# Altium schematic sheet OECU_BASE6.SchDoc
size A4; SheetNumber: 6; SheetTotal: 6
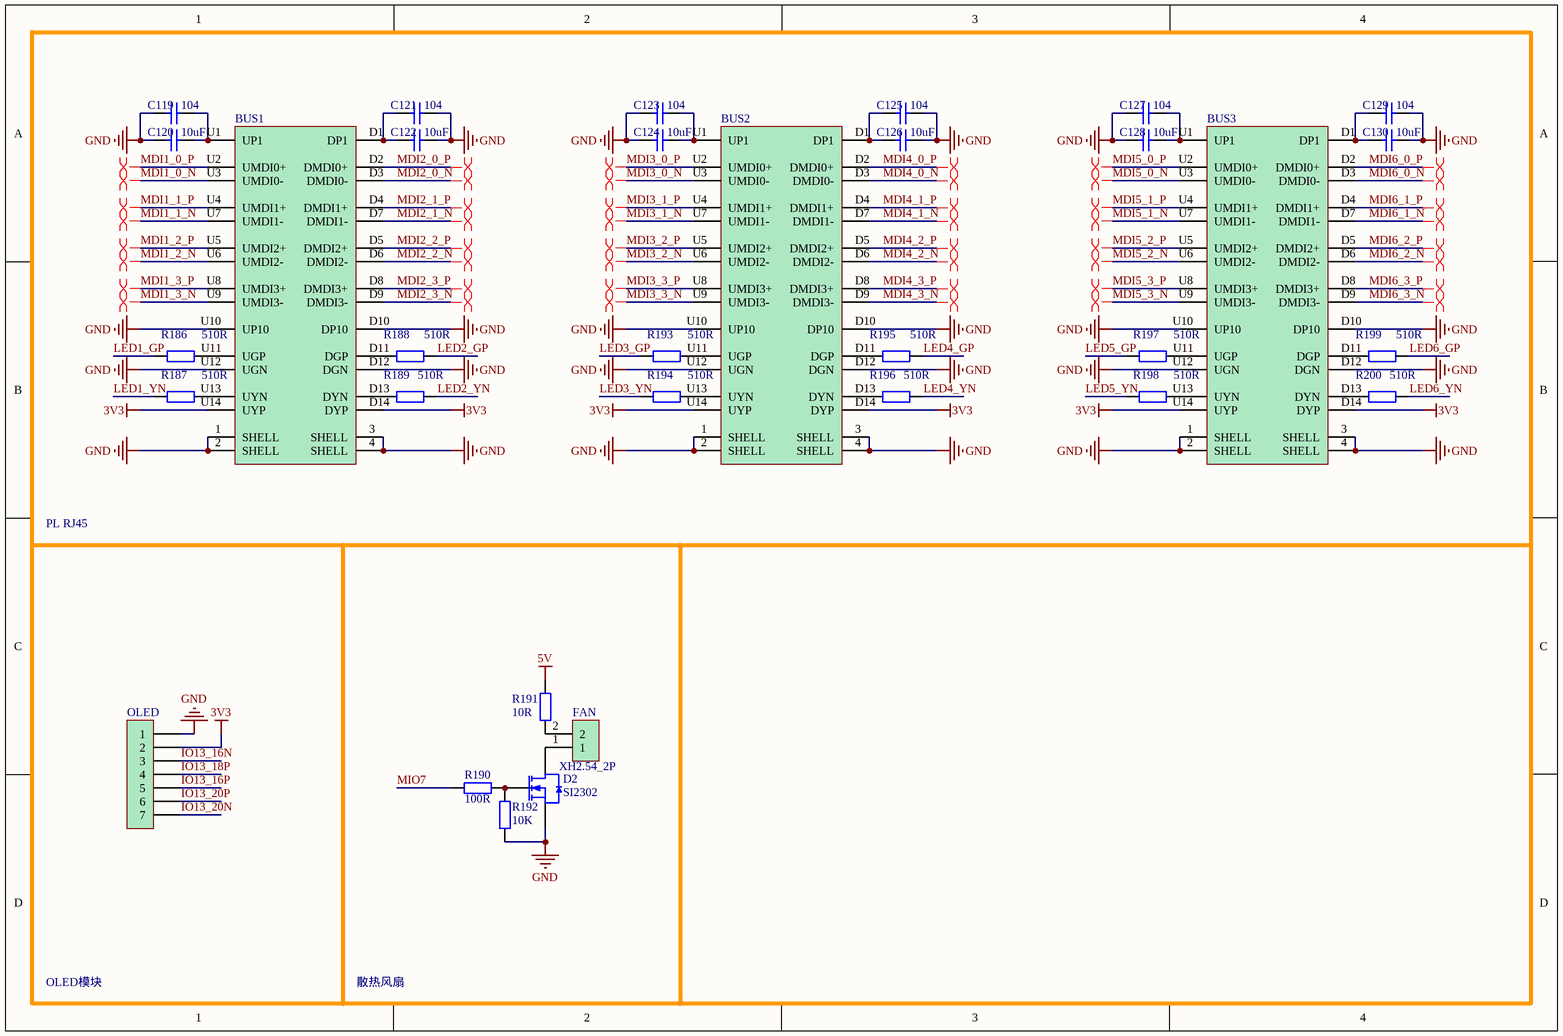
[diagram p0: OECU_BASE6.SchDoc]

## Parts
BUS1  RJ45_HR916130H  [HR916130H]  (value not drawn)
BUS2  RJ45_HR916130H  [HR916130H]  (value not drawn)
BUS3  RJ45_HR916130H  [HR916130H]  (value not drawn)
C119  104  [0402]
C120  10uF  [0402]
C121  104  [0402]
C122  10uF  [0402]
C123  104  [0402]
C124  10uF  [0402]
C125  104  [0402]
C126  10uF  [0402]
C127  104  [0402]
C128  10uF  [0402]
C129  104  [0402]
C130  10uF  [0402]
D2  SI2302  [SOT23]
FAN  XH2.54_2P  [XH2.5_2P]
OLED  Header_2.54_7P  [HDR1_7P]  (value not drawn)
R186  510R  [R_0402]
R187  510R  [R_0402]
R188  510R  [R_0402]
R189  510R  [R_0402]
R190  100R  [R_0402]
R191  10R  [R_0402]
R192  10K  [R_0402]
R193  510R  [R_0402]
R194  510R  [R_0402]
R195  510R  [R_0402]
R196  510R  [R_0402]
R197  510R  [R_0402]
R198  510R  [R_0402]
R199  510R  [R_0402]
R200  510R  [R_0402]

## Nets
3V3: BUS1.D14(DYP) BUS1.U14(UYP) BUS2.D14(DYP) BUS2.U14(UYP) BUS3.D14(DYP) BUS3.U14(UYP) OLED.2
5V: R191.1
GND: BUS1.1(SHELL) BUS1.2(SHELL) BUS1.3(SHELL) BUS1.4(SHELL) BUS1.D10(DP10) BUS1.D12(DGN) BUS1.U10(UP10) BUS1.U12(UGN) BUS2.1(SHELL) BUS2.2(SHELL) BUS2.3(SHELL) BUS2.4(SHELL) BUS2.D10(DP10) BUS2.D12(DGN) BUS2.U10(UP10) BUS2.U12(UGN) BUS3.1(SHELL) BUS3.2(SHELL) BUS3.3(SHELL) BUS3.4(SHELL) BUS3.D10(DP10) BUS3.D12(DGN) BUS3.U10(UP10) BUS3.U12(UGN) C119.1 C120.1 C121.1 C122.1 C123.1 C124.1 C125.1 C126.1 C127.1 C128.1 C129.1 C130.1 D2.2(S) OLED.1 R192.2
IO13_16N: OLED.3
IO13_16P: OLED.5
IO13_18P: OLED.4
IO13_20N: OLED.7
IO13_20P: OLED.6
LED1_GP: R186.1
LED1_YN: R187.1
LED2_GP: R188.2
LED2_YN: R189.1
LED3_GP: R193.1
LED3_YN: R194.1
LED4_GP: R195.2
LED4_YN: R196.1
LED5_GP: R197.1
LED5_YN: R198.1
LED6_GP: R199.2
LED6_YN: R200.1
MDI1_0_N: BUS1.U3(UMDI0-)
MDI1_0_P: BUS1.U2(UMDI0+)
MDI1_1_N: BUS1.U7(UMDI1-)
MDI1_1_P: BUS1.U4(UMDI1+)
MDI1_2_N: BUS1.U6(UMDI2-)
MDI1_2_P: BUS1.U5(UMDI2+)
MDI1_3_N: BUS1.U9(UMDI3-)
MDI1_3_P: BUS1.U8(UMDI3+)
MDI2_0_N: BUS1.D3(DMDI0-)
MDI2_0_P: BUS1.D2(DMDI0+)
MDI2_1_N: BUS1.D7(DMDI1-)
MDI2_1_P: BUS1.D4(DMDI1+)
MDI2_2_N: BUS1.D6(DMDI2-)
MDI2_2_P: BUS1.D5(DMDI2+)
MDI2_3_N: BUS1.D9(DMDI3-)
MDI2_3_P: BUS1.D8(DMDI3+)
MDI3_0_N: BUS2.U3(UMDI0-)
MDI3_0_P: BUS2.U2(UMDI0+)
MDI3_1_N: BUS2.U7(UMDI1-)
MDI3_1_P: BUS2.U4(UMDI1+)
MDI3_2_N: BUS2.U6(UMDI2-)
MDI3_2_P: BUS2.U5(UMDI2+)
MDI3_3_N: BUS2.U9(UMDI3-)
MDI3_3_P: BUS2.U8(UMDI3+)
MDI4_0_N: BUS2.D3(DMDI0-)
MDI4_0_P: BUS2.D2(DMDI0+)
MDI4_1_N: BUS2.D7(DMDI1-)
MDI4_1_P: BUS2.D4(DMDI1+)
MDI4_2_N: BUS2.D6(DMDI2-)
MDI4_2_P: BUS2.D5(DMDI2+)
MDI4_3_N: BUS2.D9(DMDI3-)
MDI4_3_P: BUS2.D8(DMDI3+)
MDI5_0_N: BUS3.U3(UMDI0-)
MDI5_0_P: BUS3.U2(UMDI0+)
MDI5_1_N: BUS3.U7(UMDI1-)
MDI5_1_P: BUS3.U4(UMDI1+)
MDI5_2_N: BUS3.U6(UMDI2-)
MDI5_2_P: BUS3.U5(UMDI2+)
MDI5_3_N: BUS3.U9(UMDI3-)
MDI5_3_P: BUS3.U8(UMDI3+)
MDI6_0_N: BUS3.D3(DMDI0-)
MDI6_0_P: BUS3.D2(DMDI0+)
MDI6_1_N: BUS3.D7(DMDI1-)
MDI6_1_P: BUS3.D4(DMDI1+)
MDI6_2_N: BUS3.D6(DMDI2-)
MDI6_2_P: BUS3.D5(DMDI2+)
MDI6_3_N: BUS3.D9(DMDI3-)
MDI6_3_P: BUS3.D8(DMDI3+)
MIO7: R190.1
NetBUS1_D1: BUS1.D1(DP1) C121.2 C122.2
NetBUS1_D11: BUS1.D11(DGP) R188.1
NetBUS1_D13: BUS1.D13(DYN) R189.2
NetBUS1_U1: BUS1.U1(UP1) C119.2 C120.2
NetBUS1_U11: BUS1.U11(UGP) R186.2
NetBUS1_U13: BUS1.U13(UYN) R187.2
NetBUS2_D1: BUS2.D1(DP1) C125.2 C126.2
NetBUS2_D11: BUS2.D11(DGP) R195.1
NetBUS2_D13: BUS2.D13(DYN) R196.2
NetBUS2_U1: BUS2.U1(UP1) C123.2 C124.2
NetBUS2_U11: BUS2.U11(UGP) R193.2
NetBUS2_U13: BUS2.U13(UYN) R194.2
NetBUS3_D1: BUS3.D1(DP1) C129.2 C130.2
NetBUS3_D11: BUS3.D11(DGP) R199.1
NetBUS3_D13: BUS3.D13(DYN) R200.2
NetBUS3_U1: BUS3.U1(UP1) C127.2 C128.2
NetBUS3_U11: BUS3.U11(UGP) R197.2
NetBUS3_U13: BUS3.U13(UYN) R198.2
NetD2_1: D2.1(G) R190.2 R192.1
NetD2_3: D2.3(D) FAN.1
NetFAN_2: FAN.2 R191.2

## Layout directives
differential pair: MDI1_0_N, MDI1_0_P, MDI1_1_N, MDI1_1_P, MDI1_2_N, MDI1_2_P, MDI1_3_N, MDI1_3_P, MDI2_0_N, MDI2_0_P, MDI2_1_N, MDI2_1_P, MDI2_2_N, MDI2_2_P, MDI2_3_N, MDI2_3_P, MDI3_0_N, MDI3_0_P, MDI3_1_N, MDI3_1_P, MDI3_2_N, MDI3_2_P, MDI3_3_N, MDI3_3_P, MDI4_0_N, MDI4_0_P, MDI4_1_N, MDI4_1_P, MDI4_2_N, MDI4_2_P, MDI4_3_N, MDI4_3_P, MDI5_0_N, MDI5_0_P, MDI5_1_N, MDI5_1_P, MDI5_2_N, MDI5_2_P, MDI5_3_N, MDI5_3_P, MDI6_0_N, MDI6_0_P, MDI6_1_N, MDI6_1_P, MDI6_2_N, MDI6_2_P, MDI6_3_N, MDI6_3_P

## Notes on the sheet
- PL RJ45
- OLED模块
- 散热风扇

## Library data of the parts
C119-C130 = CAP_0402: 贴片电容 0402
D2 = MOSN_SI2302_SOT23: NMOS
R186-R200 = RES_0402: 电阻 0402